# EAGLE schematic shd_v2.1 (EAGLE 9.5.2)

## Sheet 1 of 4
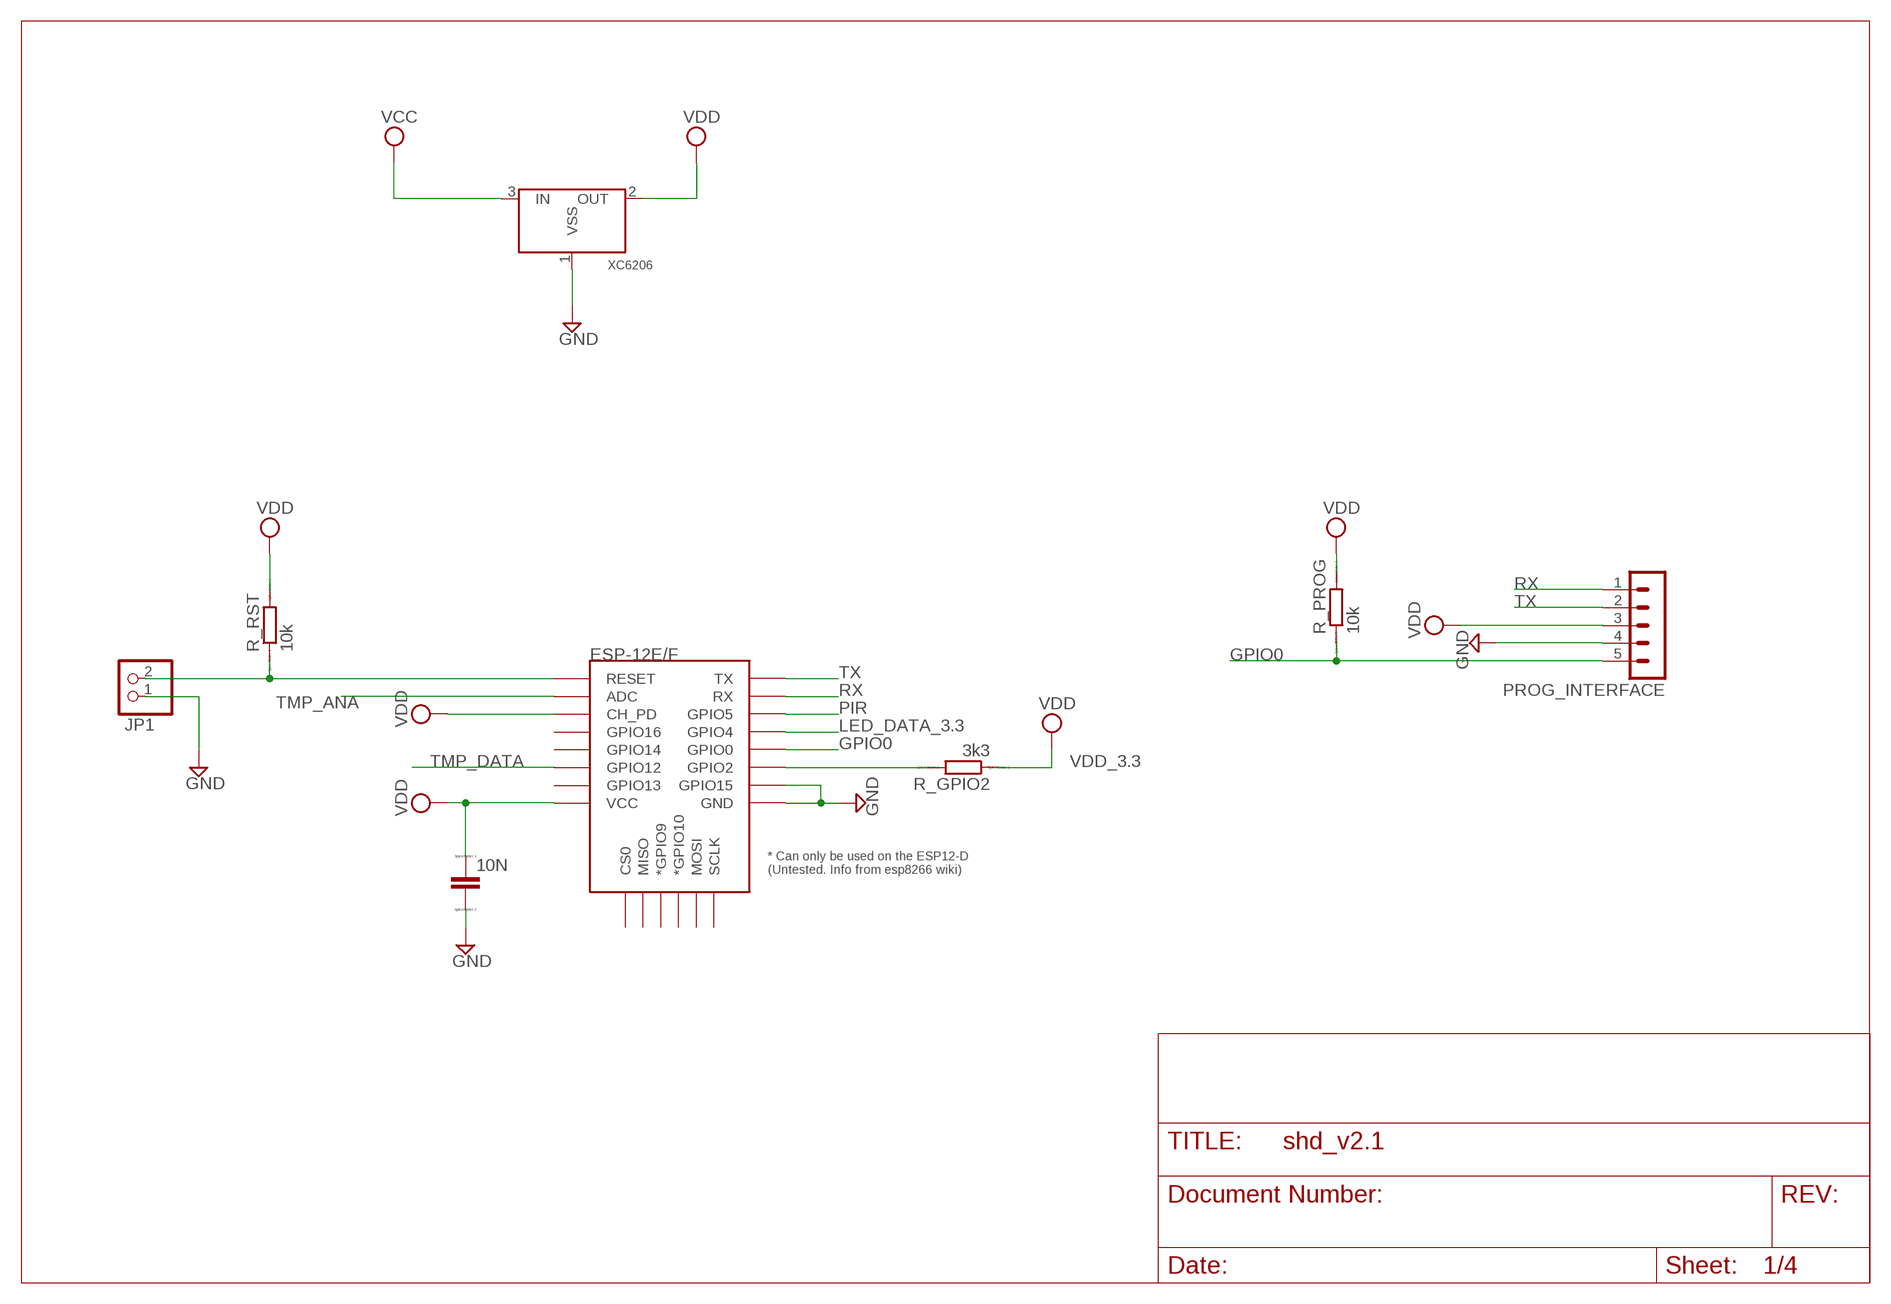
[diagram p0: schematic, sheet 1]

### Parts
10N  C  [C0805]
ESP-12E/F  ESP12ESMD  [ESP12E-SMD]
JP1  PINHD-1X2  [1X02]
PROG_INTERFACE  MA05-1  [MA05-1]
R_GPIO2  3k3  R0207/10  [0207/10]
R_PROG  10k  R0207/10  [0207/10]
R_RST  10k  R0207/10  [0207/10]
XC6206  XC6206  [SOT23]

### Nets
GND: 10N.2 ESP-12E/F.GND ESP-12E/F.GPIO15 JP1.1 PROG_INTERFACE.4 XC6206.1(VSS) ; also sheet 2,3,4
GPIO0: ESP-12E/F.GPIO0 PROG_INTERFACE.5 R_PROG.1
LED_DATA_3.3: ESP-12E/F.GPIO4 ; also sheet 2
N$2: ESP-12E/F.GPIO2 R_GPIO2.2
PIR: ESP-12E/F.GPIO5 ; also sheet 3
RST: ESP-12E/F.RESET JP1.2 R_RST.1
RX: ESP-12E/F.RXD0(RX) PROG_INTERFACE.1
TMP_ANA: ESP-12E/F.ADC ; also sheet 2
TMP_DATA: ESP-12E/F.GPIO12 ; also sheet 2
TX: ESP-12E/F.TXD0(TX) PROG_INTERFACE.2
VCC_5.0: XC6206.3(IN) ; supply symbol labelled VCC ; also sheet 2,3,4
VDD_3.3: 10N.1 ESP-12E/F.CH_PD ESP-12E/F.VCC PROG_INTERFACE.3 R_GPIO2.1 R_PROG.2 R_RST.2 XC6206.2(OUT) ; supply symbol labelled VDD ; also sheet 2
Unconnected: ESP-12E/F.CS0 ESP-12E/F.GPIO9(*GPIO9) ESP-12E/F.GPIO10(*GPIO10) ESP-12E/F.GPIO13 ESP-12E/F.GPIO14 ESP-12E/F.GPIO16 ESP-12E/F.MISO ESP-12E/F.MOSI ESP-12E/F.SCLK

## Sheet 2 of 4
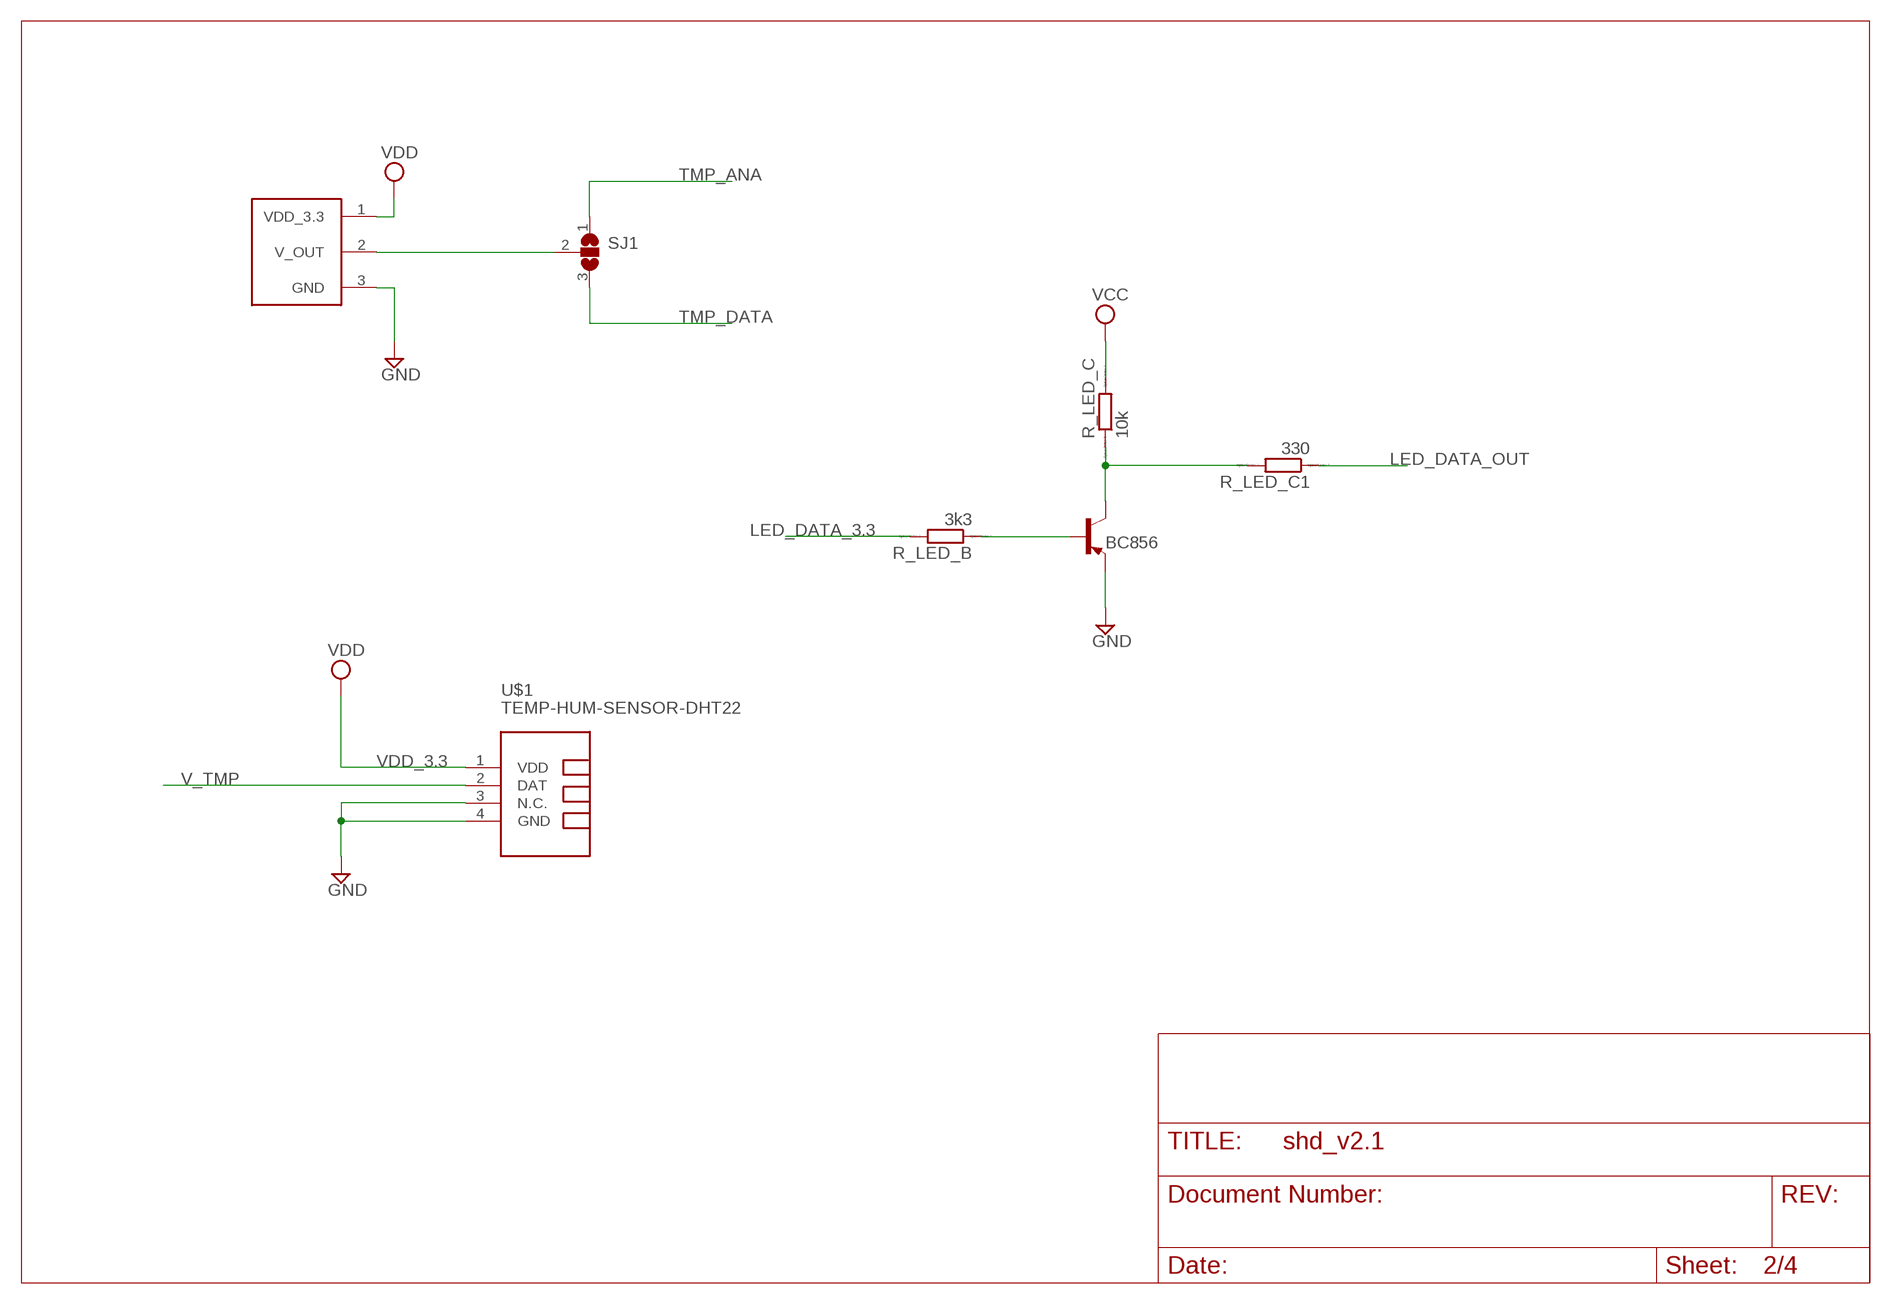
[diagram p1: schematic, sheet 2]

### Parts
BC856  BC856A-PNP-SOT23-BEC  [SOT23-BEC]
R_LED_B  3k3  R0207/10  [0207/10]
R_LED_C  10k  R0207/10  [0207/10]
R_LED_C1  330  R0207/10  [0207/10]
SJ1  SJ2W  [SJ_2]
TMP  TMP36  [TO-92]
U$1  TEMP-HUM-SENSOR-DHT22  [TEMP-HUM-SENSOR-DHT22]

### Nets
GND: BC856.E TMP.3(GND) U$1.3(N.C.) U$1.4(GND) ; also sheet 1,3,4
LED_DATA_3.3: R_LED_B.2 ; also sheet 1
LED_DATA_3.3_R: BC856.B R_LED_B.1
LED_DATA_5.0: BC856.C R_LED_C1.2 R_LED_C.1
LED_DATA_OUT: R_LED_C1.1 ; also sheet 3
TMP_ANA: SJ1.1 ; also sheet 1
TMP_DATA: SJ1.3 ; also sheet 1
V_TMP: SJ1.2 TMP.2(V_OUT) U$1.2(DAT)
VCC_5.0: R_LED_C.2 ; supply symbol labelled VCC ; also sheet 1,3,4
VDD_3.3: TMP.1(VDD_3.3) U$1.1(VDD) ; supply symbol labelled VDD ; also sheet 1

## Sheet 3 of 4
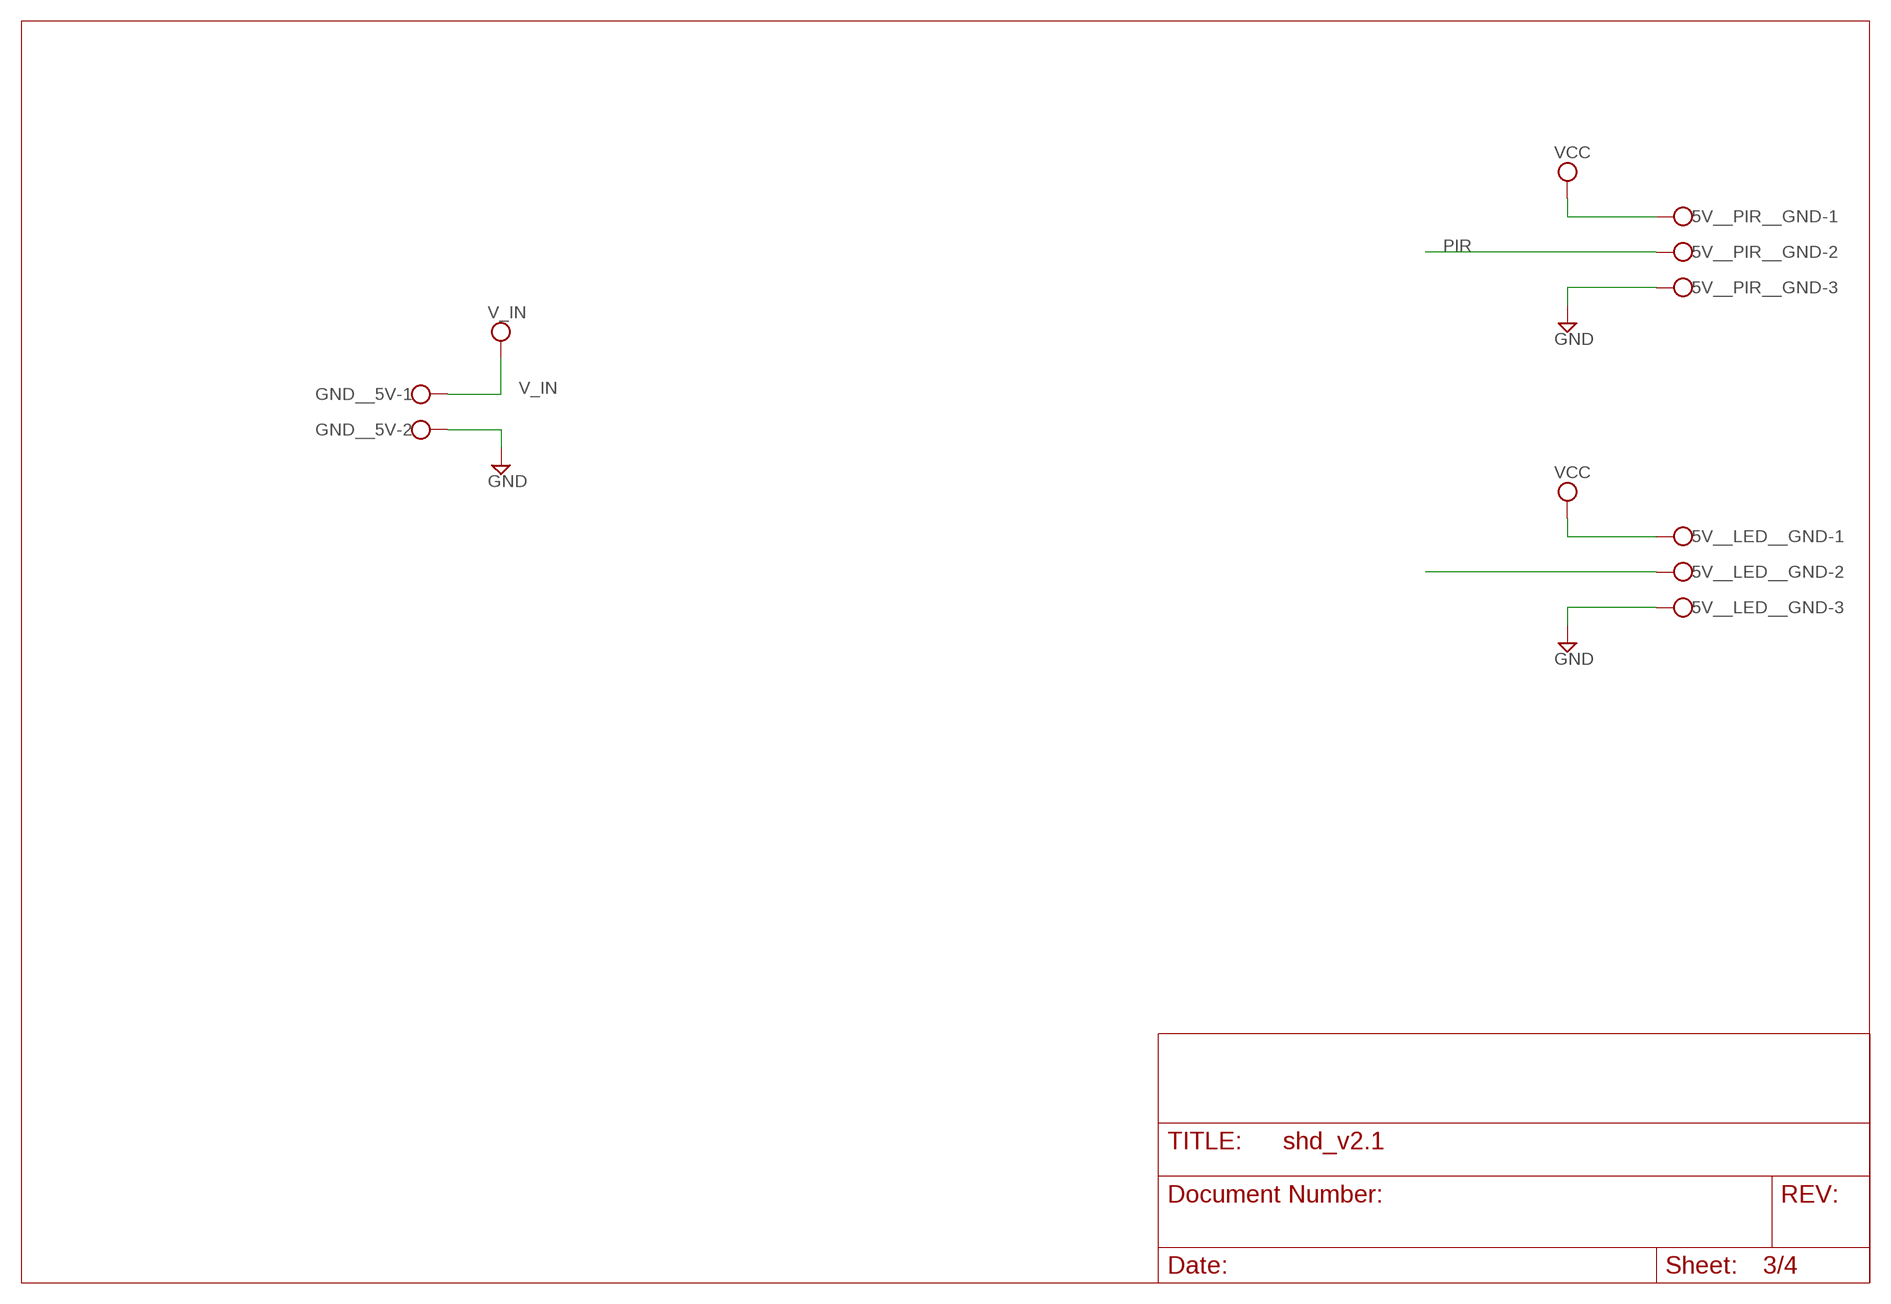
[diagram p2: schematic, sheet 3]

### Parts
5V__LED__GND  W237-103  [W237-103]
5V__PIR__GND  W237-103  [W237-103]
GND__5V  W237-102  [W237-102]

### Nets
GND: 5V__LED__GND.3 5V__PIR__GND.3 GND__5V.2 ; also sheet 1,2,4
LED_DATA_OUT: 5V__LED__GND.2 ; also sheet 2
PIR: 5V__PIR__GND.2 ; also sheet 1
V_IN: GND__5V.1 ; also sheet 4
VCC_5.0: 5V__LED__GND.1 5V__PIR__GND.1 ; supply symbol labelled VCC ; also sheet 1,2,4

## Sheet 4 of 4
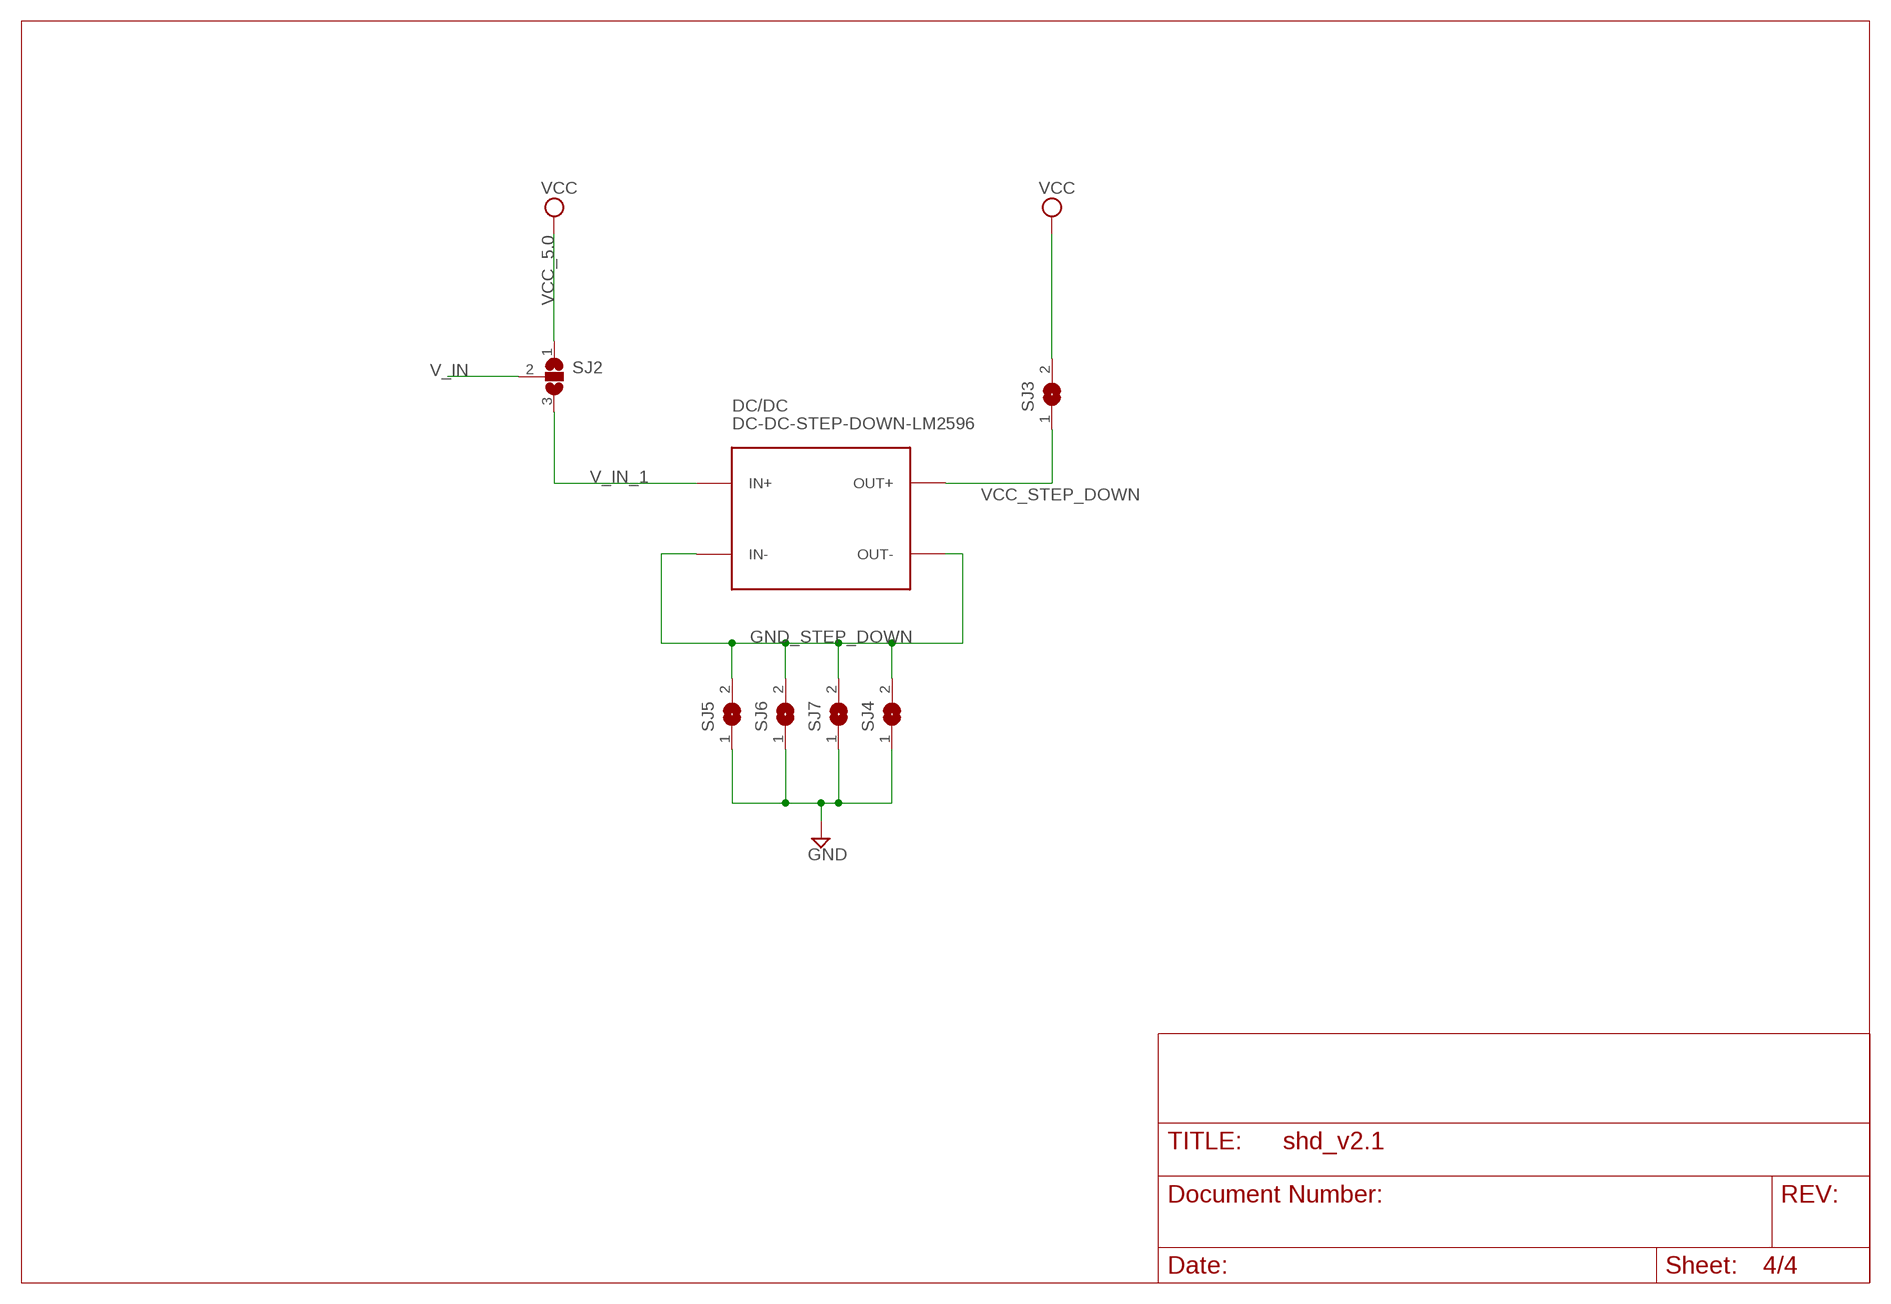
[diagram p3: schematic, sheet 4]

### Parts
DC/DC  DC-DC-STEP-DOWN-LM2596  [DC-DC-STEP-DOWN-LM2596]
SJ2  SJ2W  [SJ_2]
SJ3  SJ  [SJ]
SJ4  SJ  [SJ]
SJ5  SJ  [SJ]
SJ6  SJ  [SJ]
SJ7  SJ  [SJ]

### Nets
GND: SJ4.1 SJ5.1 SJ6.1 SJ7.1 ; also sheet 1,2,3
GND_STEP_DOWN: DC/DC.IN- DC/DC.OUT- SJ4.2 SJ5.2 SJ6.2 SJ7.2
V_IN: SJ2.2 ; also sheet 3
V_IN_1: DC/DC.IN+ SJ2.3
VCC_5.0: SJ2.1 SJ3.2 ; supply symbol labelled VCC ; also sheet 1,2,3
VCC_STEP_DOWN: DC/DC.OUT+ SJ3.1

## Library data of the parts
5V__LED__GND 5V__PIR__GND = con-wago-500:W237-103: WAGO SCREW CLAMP; MPN: 237-103; OC_FARNELL: unknown; OC_NEWARK: 18M7116
10N = eagle-ltspice:C: CAPACITOR, European symbol; SPICEMODEL: NONE; SPICEPREFIX: C
BC856 = transistor:*-PNP-: PNP Transistror
DC/DC = diy-modules:DC-DC-STEP-DOWN-LM2596: DC/DC Step-Down Regulator based on LM2596-ADJ chip LM2596 datasheet available here: http://www.ti.com/lit/ds/symlink/lm2596.pdf Click here to find device on ebay.com <http://www.ebay.com/sch/lm2596+power+regulator>
ESP-12E/F = esp8266modules:ESP12E: ESP12E Module
GND__5V = con-wago-500:W237-102: WAGO SCREW CLAMP; MPN: 237-102; OC_FARNELL: unknown; OC_NEWARK: 70K9898
JP1 = pinhead:PINHD-1X2: PIN HEADER
PROG_INTERFACE = con-lstb:MA05-1: PIN HEADER; OC_FARNELL: unknown; OC_NEWARK: unknown
R_GPIO2 R_LED_B R_LED_C R_LED_C1 R_PROG R_RST = eagle-ltspice:R: RESISTOR, European symbol; SPICEMODEL: NONE; SPICEPREFIX: R
SJ1 SJ2 = jumper:SJ2W: SMD solder JUMPER
SJ3-SJ7 = jumper:SJ: SMD solder JUMPER
TMP = tmp36:TMP36
U$1 = diy-modules:TEMP-HUM-SENSOR-DHT22: DHT22 - digital humidity & temperature sensor Also known as: AM2302 AM2302 datasheet available here: http://akizukidenshi.com/download/ds/aosong/AM2302.pdf Click here to find device on ebay.com <http://www.ebay.com/sch/dht22+digital+sensor>
XC6206 = Voltage Regulator:XC6206: XC6206P , linear regulator. Producted by TOREX.Co Store Information: EXCEL device corporation http://www.excel-d.com/access/index.html